# EAGLE design FAROS DE LUZ (EAGLE 9.6.2)
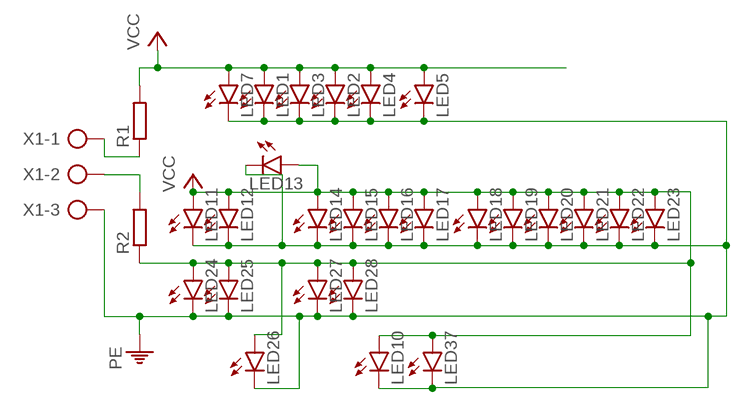
[diagram p0: schematic, sheet 1]

## Parts
LED1  LED10MM  [LED10MM]
LED2  LED10MM  [LED10MM]
LED3  LED10MM  [LED10MM]
LED4  LED10MM  [LED10MM]
LED5  LED10MM  [LED10MM]
LED7  LED10MM  [LED10MM]
LED10  LED5MM  [LED5MM]
LED11  LED5MM  [LED5MM]
LED12  LED5MM  [LED5MM]
LED13  LED5MM  [LED5MM]
LED14  LED5MM  [LED5MM]
LED15  LED5MM  [LED5MM]
LED16  LED5MM  [LED5MM]
LED17  LED5MM  [LED5MM]
LED18  LED5MM  [LED5MM]
LED19  LED5MM  [LED5MM]
LED20  LED5MM  [LED5MM]
LED21  LED5MM  [LED5MM]
LED22  LED5MM  [LED5MM]
LED23  LED5MM  [LED5MM]
LED24  LED5MM  [LED5MM]
LED25  LED5MM  [LED5MM]
LED26  LED5MM  [LED5MM]
LED27  LED5MM  [LED5MM]
LED28  LED5MM  [LED5MM]
LED37  LED5MM  [LED5MM]
R1  R-EU_0204/7  [0204/7]
R2  R-EU_0204/7  [0204/7]
X1  AK500/3-H  [AK500/3-H]

## Nets
N$4: R1.1 X1.1
N$6: R2.2 X1.2
PE: LED1.K(C) LED2.K(C) LED3.K(C) LED4.K(C) LED5.K(C) LED7.K(C) LED10.K(C) LED11.K(C) LED12.K(C) LED13.K(C) LED14.K(C) LED15.K(C) LED16.K(C) LED17.K(C) LED18.K(C) LED19.K(C) LED20.K(C) LED21.K(C) LED22.K(C) LED23.K(C) LED24.K(C) LED25.K(C) LED26.K(C) LED27.K(C) LED28.K(C) LED37.K(C) X1.3
VCC: LED1.A LED2.A LED3.A LED4.A LED5.A LED7.A LED10.A LED11.A LED12.A LED13.A LED14.A LED15.A LED16.A LED17.A LED18.A LED19.A LED20.A LED21.A LED22.A LED23.A LED24.A LED25.A LED26.A LED27.A LED28.A LED37.A R1.2 R2.1

## Library data of the parts
LED1-LED5 LED7 LED10-LED28 LED37 = led:LED: LED OSRAM: - CHIPLED LG R971, LG N971, LY N971, LG Q971, LY Q971, LO R971, LY R971 LH N974, LH R974 LS Q976, LO Q976, LY Q976 LO Q996 - Hyper CHIPLED LW Q18S LB Q993, LB Q99A, LB R99A - SideLED LS A670, LO A670, LY A670, LG A670, LP A670 LB A673, LV A673, LT A673, LW A673 LH A674 LY A675 LS A676, LA A676, LO A676, LY A676, LW A676 LS A679, LY A679, LG A679 - Hyper Micro SIDELED® LS Y876, LA Y876, LO Y876, LY Y876 LT Y87S - SmartLED LW L88C, LW L88S LB L89C, LB L89S, LG L890 LS L89K, LO L89K, LY L89K LS L896, LA L896, LO L896, LY L896 - TOPLED LS T670, LO T670, LY T670, LG T670, LP T670 LSG T670, LSP T670, LSY T670, LOP T670, LYG T670 LG T671, LOG T671, LSG T671 LB T673, LV T673, LT T673, LW T673 LH T674 LS T676, LA T676, LO T676, LY T676, LB T676, LH T676, LSB T676, LW T676 LB T67C, LV T67C, LT T67C, LS T67K, LO T67K, LY T67K, LW E67C LS E67B, LA E67B, LO E67B, LY E67B, LB E67C, LV E67C, LT E67C LW T67C LS T679, LY T679, LG T679 LS T770, LO T770, LY T770, LG T770, LP T770 LB T773, LV T773, LT T773, LW T773 LH T774 LS E675, LA E675, LY E675, LS T675 LS T776, LA T776, LO T776, LY T776, LB T776 LHGB T686 LT T68C, LB T68C - Hyper Mini TOPLED® LB M676 - Mini TOPLED Santana® LG M470 LS M47K, LO M47K, LY M47K Source: http://www.osram.convergy.de LUXEON: - LUMILED® LXK2-PW12-R00, LXK2-PW12-S00, LXK2-PW14-U00, LXK2-PW14-V00 LXK2-PM12-R00, LXK2-PM12-S00, LXK2-PM14-U00 LXK2-PE12-Q00, LXK2-PE12-R00, LXK2-PE12-S00, LXK2-PE14-T00, LXK2-PE14-U00 LXK2-PB12-K00, LXK2-PB12-L00, LXK2-PB12-M00, LXK2-PB14-N00, LXK2-PB14-P00, LXK2-PB14-Q00 LXK2-PR12-L00, LXK2-PR12-M00, LXK2-PR14-Q00, LXK2-PR14-R00 LXK2-PD12-Q00, LXK2-PD12-R00, LXK2-PD12-S00 LXK2-PH12-R00, LXK2-PH12-S00 LXK2-PL12-P00, LXK2-PL12-Q00, LXK2-PL12-R00 Source: www.luxeon.com KINGBRIGHT: KA-3528ASYC Source: www.kingbright.com
R1 R2 = rcl:R-EU_: RESISTOR, European symbol; SPICEPREFIX: R
X1 = con-ptr500:AK500/3-H: CONNECTOR Aug. 2004 / PTR Meßtechnik: Die Bezeichnung der Serie AK505 wurde geändert. Es handelt sich hierbei um AK500 in horizontaler Ausführung.; OC_FARNELL: unknown; OC_NEWARK: unknown

## Board
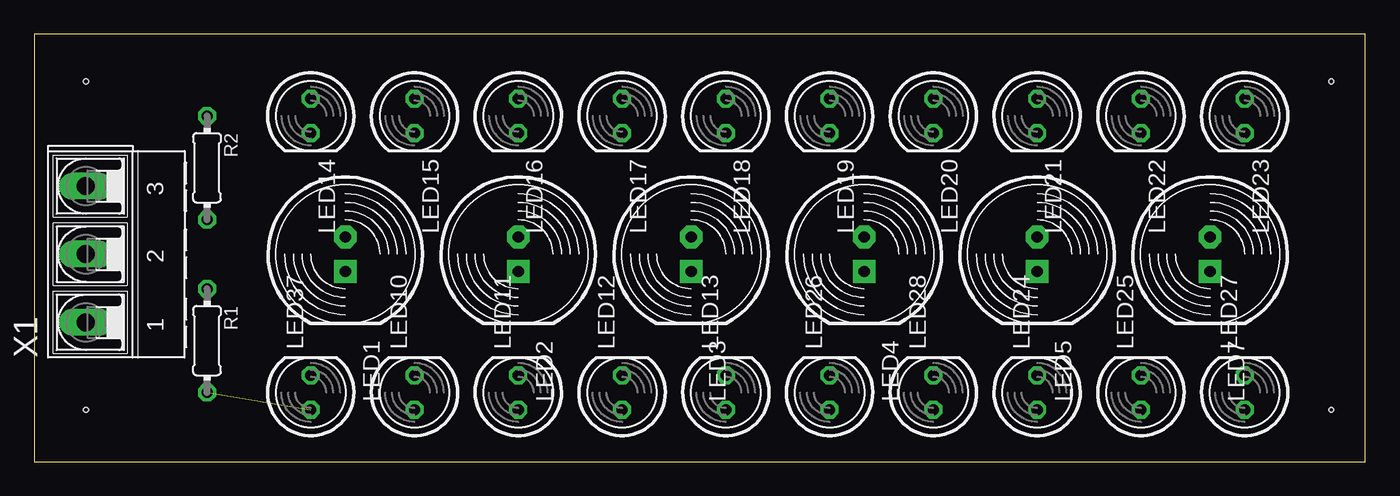
[diagram p1: board, top side]
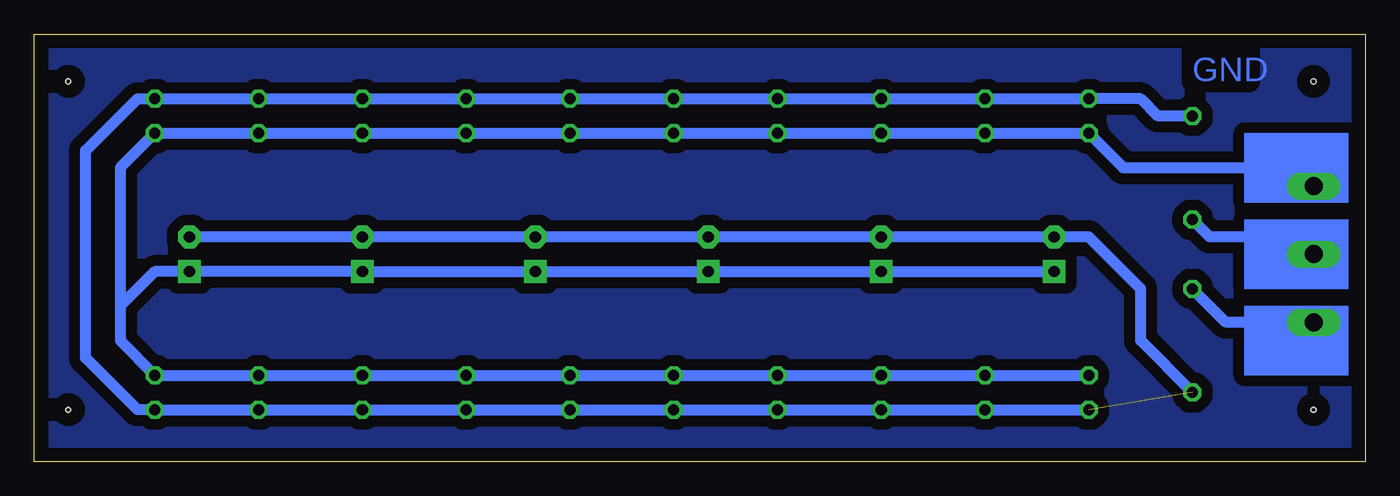
[diagram p2: board, bottom side, seen from below]

Size 97.77 x 31.42 mm. Coordinates in mm from the lower left corner, seen from the top.
Outline: 0,0 97.77,0 97.77,31.42 0,31.42 0,0
Copper layers (1*16): Top 0.035mm / dielectric 1.5mm / Bottom 0.035mm
Design rules "default *": minimum track width 6mil, minimum drill 0.35mm, track to track 6mil, track to pad 6mil, pad to pad 6mil, via to via 6mil, smd to smd 6mil, copper to edge 40mil, drill to drill 6mil, minimum pad ring 10mil, minimum via ring 8mil, stop-mask expansion 4mil, vias tented up to drill 0mil, thermal gap 10mil
Holes 0.35 mm at 3.81,27.94 3.81,3.81 95.25,3.81 95.25,27.94

### Footprints (pad centres in the part's own frame; a part is rotated, then mirrored left to right if it is on the bottom)
LED10MM = drill 0.813 pad 1.676 octagon: A -1.27,0 | drill 0.813 pad 1.676 square: K 1.27,0
LED5MM = drill 0.813 octagon: A -1.27,0; K 1.27,0
0204/7 = drill 0.813 octagon: 1 -3.81,0; 2 3.81,0
AK500/3-H = drill 1.321 long: 1 -5.004,0; 2 0,0; 3 5.004,0

### Placement (x,y rotation side)
LED1  22.86,15.24 270 top
LED2  35.56,15.24 270 top
LED3  48.26,15.24 270 top
LED4  60.96,15.24 270 top
LED5  73.66,15.24 270 top
LED7  86.36,15.24 270 top
LED10  27.94,5.08 90 top
LED11  35.56,5.08 90 top
LED12  43.18,5.08 90 top
LED13  50.8,5.08 90 top
LED14  20.32,25.4 270 top
LED15  27.94,25.4 270 top
LED16  35.56,25.4 270 top
LED17  43.18,25.4 270 top
LED18  50.8,25.4 270 top
LED19  58.42,25.4 270 top
LED20  66.04,25.4 270 top
LED21  73.66,25.4 270 top
LED22  81.28,25.4 270 top
LED23  88.9,25.4 270 top
LED24  73.66,5.08 90 top
LED25  81.28,5.08 90 top
LED26  58.42,5.08 90 top
LED27  88.9,5.08 90 top
LED28  66.04,5.08 90 top
LED37  20.32,5.08 90 top
R1  12.7,8.89 270 top
R2  12.7,21.59 270 top
X1  3.81,15.24 90 top

### Tracks (layer width: path | path; a pad name or v marks a point on that pad's centre or on a via)
F
  pour Bottom (isolate 0.813): 1.27,30.48 1.27,1.27 96.52,1.27 96.52,30.48
N$4
  Bottom 0.813: X1.1 10.24,10.24 R1.1
N$6
  Bottom 0.813: X1.2 5.08,16.51 11.43,16.51 R2.2
PE
  Bottom 0.813: X1.3 5.16,21.59 17.78,21.59 LED14.K LED15.K LED16.K LED17.K LED18.K LED19.K LED20.K LED21.K LED22.K LED23.K 91.44,21.59 91.44,11.43 | LED1.K LED2.K LED3.K LED4.K LED5.K LED7.K 88.9,13.97 91.44,11.43 | LED37.K LED10.K LED11.K LED12.K LED13.K LED26.K LED28.K LED24.K LED25.K LED27.K 91.44,8.89 91.44,11.43
VCC  (1 unrouted)
  Bottom 0.813: LED37.A LED10.A LED11.A LED12.A LED13.A LED26.A LED28.A LED24.A LED25.A LED27.A 90.17,3.81 93.98,7.62 93.98,22.86 90.17,26.67 LED23.A LED22.A LED21.A LED20.A LED19.A LED18.A LED17.A LED16.A LED15.A LED14.A 16.51,26.67 15.24,25.4 R2.1 | LED7.A LED5.A LED4.A LED3.A LED2.A LED1.A 21.59,16.51 20.32,16.51 16.51,12.7 16.51,8.89 R1.2
(copper drawn outside any net)
  shapes: Bottom area x3

### Text on the board
Bottom: GND